# EAGLE design LED Tester (EAGLE 9.6.2)
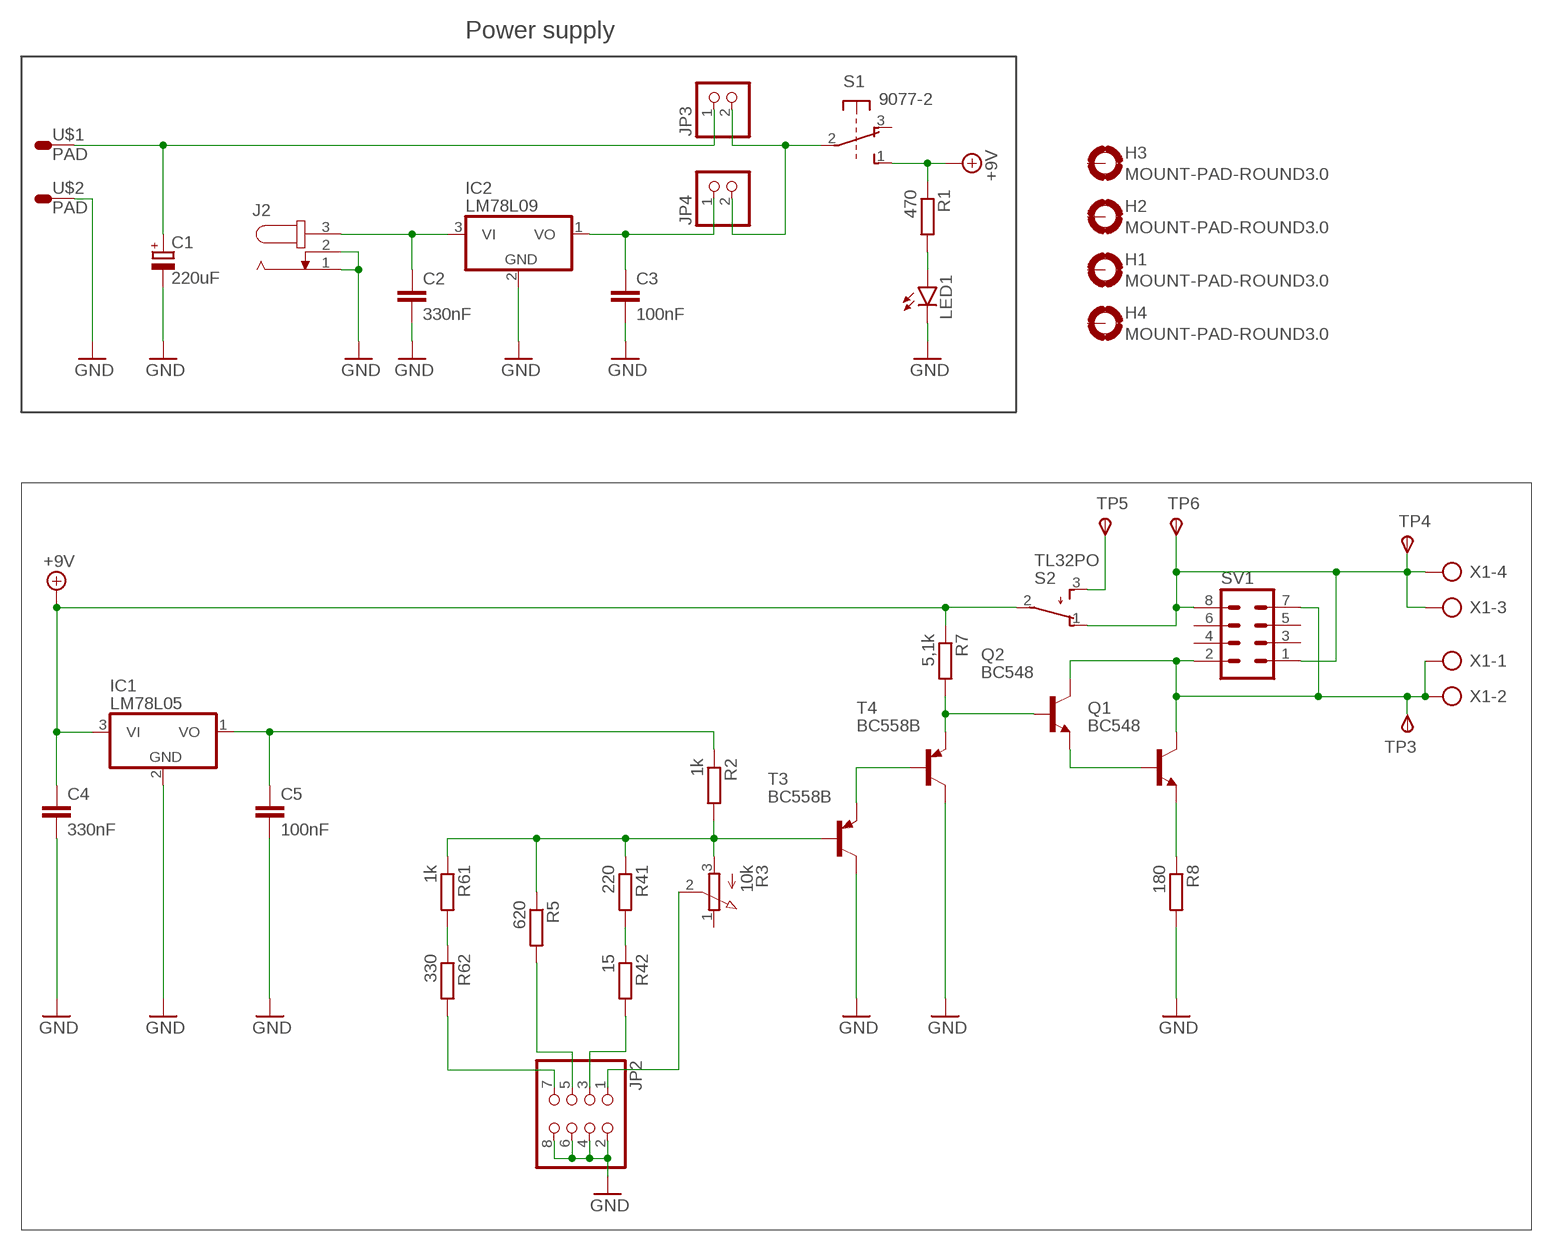
[diagram p0: schematic, sheet 1]

## Parts
C1  220uF  CPOL-EUE3.5-8  [E3,5-8]
C2  330nF  C-EU050-024X044  [C050-024X044]
C3  100nF  C-EU050-024X044  [C050-024X044]
C4  330nF  C-EU050-024X044  [C050-024X044]
C5  100nF  C-EU050-024X044  [C050-024X044]
H1  MOUNT-PAD-ROUND3.0  [3,0-PAD]
H2  MOUNT-PAD-ROUND3.0  [3,0-PAD]
H3  MOUNT-PAD-ROUND3.0  [3,0-PAD]
H4  MOUNT-PAD-ROUND3.0  [3,0-PAD]
IC1  LM78L05  LM78LXX  [TO92]
IC2  LM78L09  LM78LXX  [TO92]
J2  JACK-PLUG0  [SPC4077]
JP2  PINHD-2X4  [2X04]
JP3  PINHD-1X2  [1X02]
JP4  PINHD-1X2  [1X02]
LED1  LED3MM  [LED3MM]
Q1  BC548  [TO92-EBC]
Q2  BC548  [TO92-EBC]
R1  470  R-EU_0204/7  [0204/7]
R2  1k  R-EU_0207/10  [0207/10]
R3  10k  POT16/6MM  [POT/LAY/16/6MM]
R5  620  R-EU_0204/7  [0204/7]
R7  5,1k  R-EU_0207/10  [0207/10]
R8  180  R-EU_0204/7  [0204/7]
R41  220  R-EU_0204/7  [0204/7]
R42  15  R-EU_0204/7  [0204/7]
R61  1k  R-EU_0204/7  [0204/7]
R62  330  R-EU_0204/7  [0204/7]
S1  9077-2  [9077-2]
S2  TL32PO  [TL3XPO]
SV1  MA04-2  [MA04-2]
T3  BC558B  2N4126-PNP-TO92-CBE  [TO92-CBE]
T4  BC558B  2N4126-PNP-TO92-CBE  [TO92-CBE]
TP3  TPSPAD1-13  [P1-13]
TP4  TPSPAD1-13  [P1-13]
TP5  TPSPAD1-13  [P1-13]
TP6  TPSPAD1-13  [P1-13]
U$1  PAD  PAD/BOTTOM  [PAD/BOTTOM]
U$2  PAD  PAD/BOTTOM  [PAD/BOTTOM]
X1  AK500/4  [AK500/4]

## Nets
+9V: C4.1 IC1.3(VI) R1.1 R7.1 S1.1(1:S) S2.2(P)
GND: C1.- C2.2 C3.2 C4.2 C5.2 IC1.2(GND) IC2.2(GND) J2.1 J2.2 JP2.2 JP2.4 JP2.6 JP2.8 LED1.K(C) R8.2 T3.C T4.C U$2.P$1(S)
N$1: C1.+ JP3.1 U$1.P$1(S)
N$2: JP3.2 JP4.2 S1.2(1:P)
N$3: Q1.C Q2.C SV1.2 SV1.7 TP3.TP(PP) X1.1 X1.2
N$4: LED1.A R1.2
N$5: C3.1 IC2.1(VO) JP4.1
N$6: C5.1 IC1.1(VO) R2.1
N$7: C2.1 IC2.3(VI) J2.3
N$8: JP2.7 R62.2
N$9: R41.2 R42.1
N$10: Q1.E R8.1
N$11: R61.2 R62.1
N$12: JP2.5 R5.2
N$13: R2.2 R3.3(A) R5.1 R41.1 R61.1 T3.B
N$14: JP2.3 R42.2
N$15: T3.E T4.B
N$16: JP2.1 R3.2(S)
N$17: Q2.B R7.2 T4.E
N$18: Q1.B Q2.E
N$19: S2.3(S) TP5.TP(PP)
N$21: S2.1(O) SV1.1 SV1.8 TP4.TP(PP) TP6.TP(PP) X1.3 X1.4
Unconnected: H1.B3,0(MOUNT) H2.B3,0(MOUNT) H3.B3,0(MOUNT) H4.B3,0(MOUNT) R3.1(E) S1.3(1:O) S1.4(2:S) S1.5(2:P) S1.6(2:O) SV1.3 SV1.4 SV1.5 SV1.6

## Notes on the sheet
- Power supply

## Library data of the parts
C1 = rcl:CPOL-EU: POLARIZED CAPACITOR, European symbol
C2-C5 = rcl:C-EU: CAPACITOR, European symbol
H1-H4 = holes:MOUNT-PAD-ROUND: MOUNTING PAD, round
IC1 IC2 = lib_1:LM78LXX
J2 = con-jack:JACK-PLUG: DC POWER JACK Power Jack, DC, Right Angle, Through Hole, Rated 5A at 16VDC, PC Terminals Distributor: Farnell (www.Farnell.de) Drawing: 84N1161.pdf / 84N1162.pdf Manufacturer: SPC Technology (www.spctechnology.com) Type: SPC4077 / SPC 4078; OC_FARNELL: unknown; OC_NEWARK: unknown
JP2 = pinhead:PINHD-2X4: PIN HEADER
JP3 JP4 = pinhead:PINHD-1X2: PIN HEADER
LED1 = led:LED: LED OSRAM: - CHIPLED LG R971, LG N971, LY N971, LG Q971, LY Q971, LO R971, LY R971 LH N974, LH R974 LS Q976, LO Q976, LY Q976 LO Q996 - Hyper CHIPLED LW Q18S LB Q993, LB Q99A, LB R99A - SideLED LS A670, LO A670, LY A670, LG A670, LP A670 LB A673, LV A673, LT A673, LW A673 LH A674 LY A675 LS A676, LA A676, LO A676, LY A676, LW A676 LS A679, LY A679, LG A679 - Hyper Micro SIDELED® LS Y876, LA Y876, LO Y876, LY Y876 LT Y87S - SmartLED LW L88C, LW L88S LB L89C, LB L89S, LG L890 LS L89K, LO L89K, LY L89K LS L896, LA L896, LO L896, LY L896 - TOPLED LS T670, LO T670, LY T670, LG T670, LP T670 LSG T670, LSP T670, LSY T670, LOP T670, LYG T670 LG T671, LOG T671, LSG T671 LB T673, LV T673, LT T673, LW T673 LH T674 LS T676, LA T676, LO T676, LY T676, LB T676, LH T676, LSB T676, LW T676 LB T67C, LV T67C, LT T67C, LS T67K, LO T67K, LY T67K, LW E67C LS E67B, LA E67B, LO E67B, LY E67B, LB E67C, LV E67C, LT E67C LW T67C LS T679, LY T679, LG T679 LS T770, LO T770, LY T770, LG T770, LP T770 LB T773, LV T773, LT T773, LW T773 LH T774 LS E675, LA E675, LY E675, LS T675 LS T776, LA T776, LO T776, LY T776, LB T776 LHGB T686 LT T68C, LB T68C - Hyper Mini TOPLED® LB M676 - Mini TOPLED Santana® LG M470 LS M47K, LO M47K, LY M47K Source: http://www.osram.convergy.de LUXEON: - LUMILED® LXK2-PW12-R00, LXK2-PW12-S00, LXK2-PW14-U00, LXK2-PW14-V00 LXK2-PM12-R00, LXK2-PM12-S00, LXK2-PM14-U00 LXK2-PE12-Q00, LXK2-PE12-R00, LXK2-PE12-S00, LXK2-PE14-T00, LXK2-PE14-U00 LXK2-PB12-K00, LXK2-PB12-L00, LXK2-PB12-M00, LXK2-PB14-N00, LXK2-PB14-P00, LXK2-PB14-Q00 LXK2-PR12-L00, LXK2-PR12-M00, LXK2-PR14-Q00, LXK2-PR14-R00 LXK2-PD12-Q00, LXK2-PD12-R00, LXK2-PD12-S00 LXK2-PH12-R00, LXK2-PH12-S00 LXK2-PL12-P00, LXK2-PL12-Q00, LXK2-PL12-R00 Source: www.luxeon.com KINGBRIGHT: KA-3528ASYC Source: www.kingbright.com
Q1 Q2 = transistor-npn:BC548*: NPN Transistor
R1 R2 R5 R7 R8 R41 R42 R61 R62 = rcl:R-EU_: RESISTOR, European symbol; SPICEPREFIX: R
R3 = lib_1:POT16/6MM
S1 = switch-misc:9077-2: MARQUARDT SWITCH 9077.0200 Distributor: Buerklin <https://www.buerklin.com/default.asp?event=ShowArtikel%2812G2822%29&l=d&jump=ArtNr_12G2822>
S2 = switch:TL32PO: TINY SWITCH ON - MOM Source: http://www2.produktinfo.conrad.com/datenblaetter/700000-724999/705152-da-01-de-Subminiaturschalter_TL_36YO.pdf
SV1 = con-lstb:MA04-2: PIN HEADER; OC_FARNELL: unknown; OC_NEWARK: unknown
T3 T4 = transistor:*-PNP-: PNP Transistror
TP3-TP6 = testpad:TPS: TEST PIN
U$1 U$2 = lib_1:PAD/BOTTOM
X1 = con-ptr500:AK500/4: CONNECTOR; OC_FARNELL: unknown; OC_NEWARK: unknown

## Board
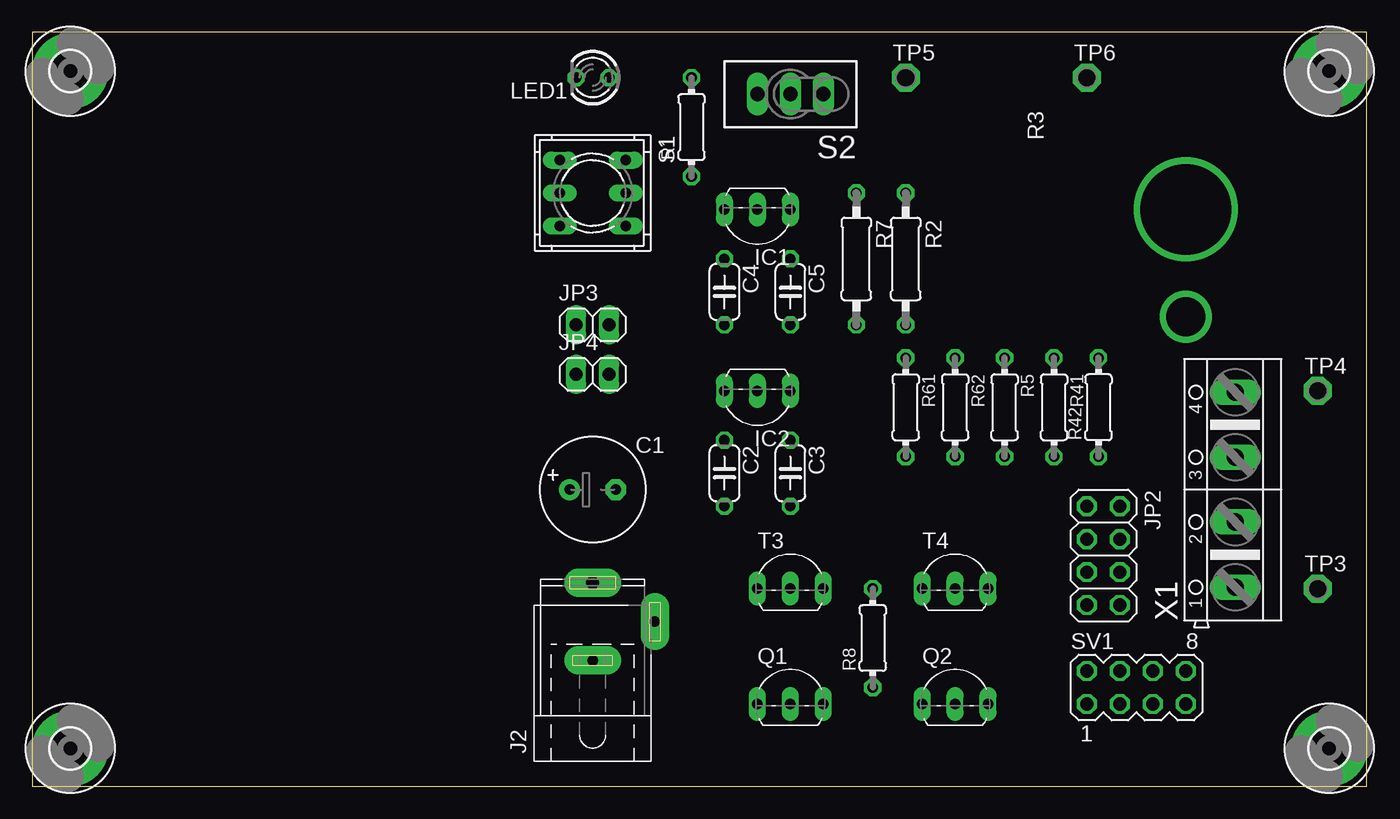
[diagram p1: board, top side]
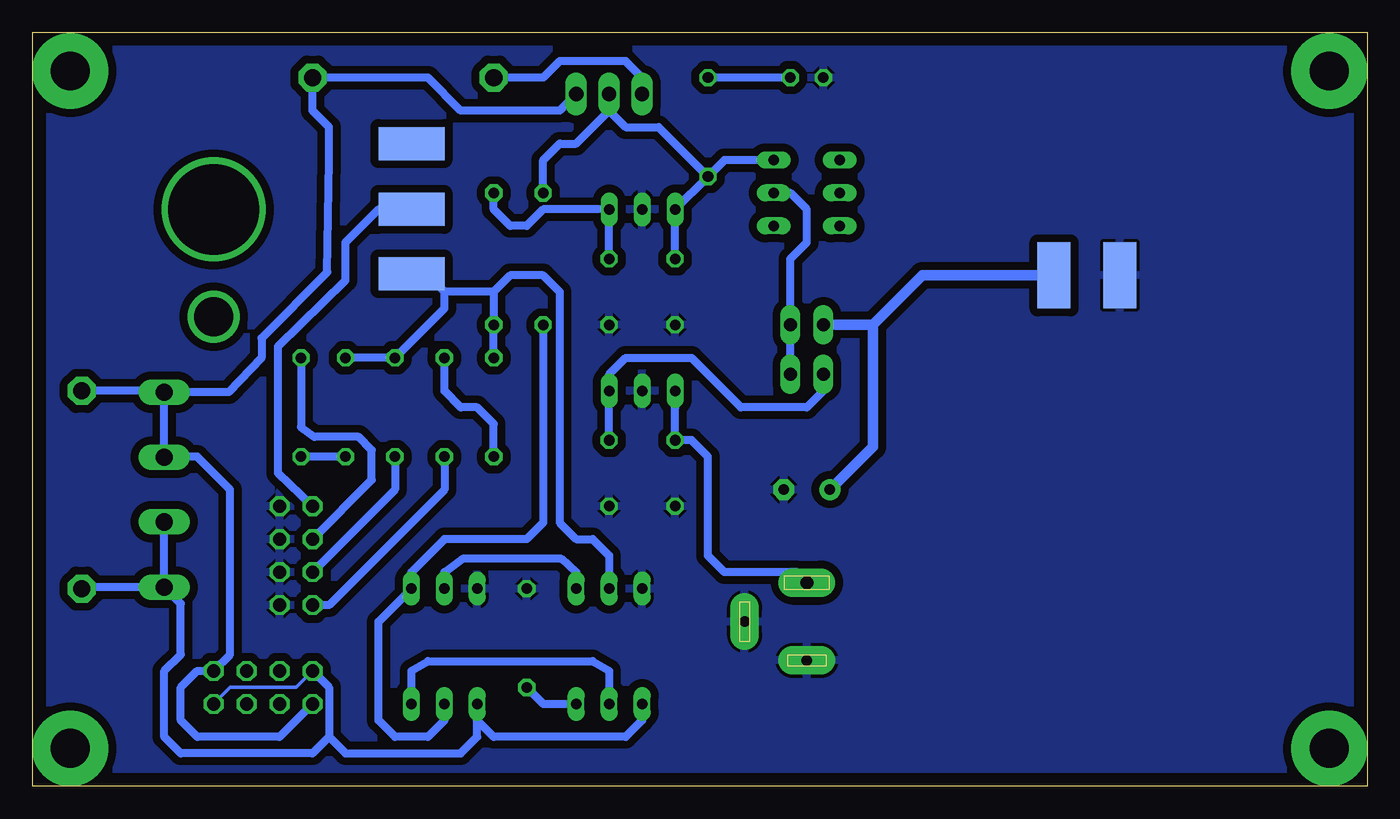
[diagram p2: board, bottom side, seen from below]

Size 102.85 x 58.09 mm. Coordinates in mm from the lower left corner, seen from the top.
Outline: 0,0 102.85,0 102.85,58.09 0,58.09 0,0
Copper layers (1*16): Top 0.035mm / dielectric 1.5mm / Bottom 0.035mm
Design rules "default": minimum track width 6mil, minimum drill 0.35mm, track to track 6mil, track to pad 6mil, pad to pad 6mil, via to via 6mil, smd to smd 6mil, copper to edge 40mil, drill to drill 6mil, minimum pad ring 10mil, minimum via ring 8mil, stop-mask expansion 4mil, vias tented up to drill 0mil, thermal gap 10mil

### Footprints (pad centres in the part's own frame; a part is rotated, then mirrored left to right if it is on the bottom)
E3,5-8 = drill 0.813 pad 1.6: + -1.778,0 | drill 0.813 pad 1.6 octagon: - 1.778,0
C050-024X044 = drill 0.813 octagon: 1 -2.54,0; 2 2.54,0
3,0-PAD = drill 3 pad 5.842: B3,0 0,0
TO92 = drill 0.813 long: 1 -2.54,0; 2 0,0; 3 2.54,0
SPC4077 = drill 0.8 pad 2.184 long: 1 -3,0; 2 0,-4.8 | drill 1 pad 2.184 long: 3 3,0
2X04 = drill 1.016 octagon: 1 -3.81,-1.27; 2 -3.81,1.27; 3 -1.27,-1.27; 4 -1.27,1.27; 5 1.27,-1.27; 6 1.27,1.27; 7 3.81,-1.27; 8 3.81,1.27
1X02 = drill 1.016 long: 1 -1.27,0; 2 1.27,0
LED3MM = drill 0.813 octagon: A -1.27,0; K 1.27,0
TO92-EBC = drill 0.813 long: B 0,-1.27; C -2.54,-1.27; E 2.54,-1.27
0204/7 = drill 0.813 octagon: 1 -3.81,0; 2 3.81,0
0207/10 = drill 0.813 octagon: 1 -5.08,0; 2 5.08,0
POT/LAY/16/6MM = smd 2.54 x 5.08 bottom: 1 -5.08,-10.16; 2 0,-10.16; 3 4.953,-10.16 | drill 7: P1 0,5.08 | drill 3: P2 8.255,5.08
9077-2 = drill 0.813 long: 1 -2.54,2.54; 2 0,2.54; 3 2.54,2.54; 4 -2.54,-2.54; 5 0,-2.54; 6 2.54,-2.54
TL3XPO = drill 1.1 pad 1.422 long: 1 -2.54,0; 2 0,0; 3 2.54,0
MA04-2 = drill 1.016 octagon: 1 -3.81,-1.27; 2 -3.81,1.27; 3 -1.27,-1.27; 4 -1.27,1.27; 5 1.27,-1.27; 6 1.27,1.27; 7 3.81,-1.27; 8 3.81,1.27
TO92-CBE = drill 0.813 long: B 0,0; C -2.54,0; E 2.54,0
P1-13 = drill 1.321 pad 2.159 octagon: TP 0,0
PAD/BOTTOM = smd 2.54 x 5.08 bottom: P$1 0,0
AK500/4 = drill 1.321 long: 1 -7.518,0; 2 -2.489,0; 3 2.489,0; 4 7.518,0

### Placement (x,y rotation side)
C1  43.18,22.86 0 top
C2  53.34,24.13 270 top
C3  58.42,24.13 270 top
C4  53.34,38.1 270 top
C5  58.42,38.1 270 top
H1  2.92,2.92 0 top
H2  99.95,2.92 0 top
H3  2.92,55.12 0 top
H4  99.95,55.12 0 top
IC1  55.88,44.45 180 top
IC2  55.88,30.48 180 top
J2  43.18,12.7 90 top
JP2  82.55,17.78 270 top
JP3  43.18,35.56 0 top
JP4  43.18,31.75 0 top
LED1  43.18,54.61 180 top
Q1  58.42,7.62 0 top
Q2  71.12,7.62 0 top
R1  50.8,50.8 90 top
R2  67.31,40.64 270 top
R3  83.82,44.45 270 top
R5  74.93,29.21 270 top
R7  63.5,40.64 270 top
R8  64.77,11.43 90 top
R41  78.74,29.21 270 top
R42  82.17,29.21 90 top
R61  67.31,29.21 270 top
R62  71.12,29.21 270 top
S1  43.18,45.72 270 top
S2  58.42,53.34 180 top
SV1  85.09,7.62 0 top
T3  58.42,15.24 0 top
T4  71.12,15.24 0 top
TP3  99.06,15.24 0 top
TP4  99.06,30.48 0 top
TP5  67.31,54.61 0 top
TP6  81.28,54.61 0 top
U$1  24.13,39.37 0 top
U$2  19.05,39.37 0 top
X1  92.71,22.86 90 top

### Tracks (layer width: path | path; a pad name or v marks a point on that pad's centre or on a via)
+9V
  Bottom 0.61: C4.1 IC1.3 R1.1 | S1.1 49.53,48.26 R1.1 | S2.2 58.42,52.07 | 58.42,52.07 57.15,50.8 54.61,50.8 R1.1 | R7.1 63.5,48.26 62.23,49.53 60.96,49.53 58.42,52.07
GND
  pour Bottom (isolate 0.61): -1.27,59.69 -1.27,-2.54 105.41,-2.54 105.41,59.69
N$1
  Bottom 0.813: 38.1,35.56 JP3.1 | U$1.P$1 34.29,39.37 38.1,35.56 | C1.+ 38.1,26.16 38.1,35.56
N$2
  Bottom 0.61: 44.45,36.83 JP3.2 | JP4.2 JP3.2 | JP3.2 44.45,40.64 43.18,41.91 43.18,44.45 44.45,45.72 S1.2
N$3
  Bottom 0.254: SV1.7 87.63,7.62 82.55,7.62 SV1.2
  Bottom 0.61: Q1.C 55.88,5.08 57.15,3.81 67.31,3.81 68.58,5.08 Q2.C 68.58,3.81 69.85,2.54 78.74,2.54 80.01,3.81 | SV1.2 80.01,7.62 80.01,3.81 | 80.01,3.81 81.28,2.54 91.44,2.54 92.71,3.81 92.71,8.89 91.44,10.16 91.44,14.07 X1.1 | X1.1 X1.2 | TP3.TP 98.96,15.34 X1.1
N$4
  Bottom 0.61: LED1.A R1.2
N$5
  Bottom 0.61: JP4.1 41.91,30.48 43.18,29.21 48.26,29.21 52.07,33.02 57.15,33.02 58.42,31.75 IC2.1 C3.1
N$6
  Bottom 0.61: C5.1 IC1.1 63.5,44.45 64.77,43.18 66.04,43.18 67.31,44.45 R2.1
N$7
  Bottom 0.61: J2.3 43.99,16.51 49.53,16.51 50.8,17.78 50.8,25.4 52.07,26.67 C2.1 53.34,29.21 IC2.3
N$8
  Bottom 0.61: R62.2 71.12,22.86 80.01,13.97 JP2.7
N$9
  Bottom 0.61: R41.2 R42.1
N$10
  Bottom 0.61: R8.1 63.5,6.35 Q1.E
N$11
  Bottom 0.61: 71.12,31.75 R62.1 71.12,30.48 69.85,29.21 68.58,29.21 67.31,27.94 R61.2
N$12
  Bottom 0.61: R5.2 74.93,22.86 JP2.5
N$13
  Bottom 0.61: R41.1 R5.1 71.12,36.83 71.12,38.1 | T3.B 58.42,17.78 59.69,19.05 60.96,19.05 62.23,20.32 62.23,38.1 63.5,39.37 66.04,39.37 67.31,38.1 | 73.79,39.5 R3.3 73.66,39.37 72.39,39.37 71.12,38.1 | R61.1 R2.2 67.31,38.1 | 67.31,38.1 71.12,38.1
N$14
  Bottom 0.61: R42.2 82.17,27.69 81.15,26.92 77.72,26.92 76.71,25.91 76.71,23.62 JP2.3
N$15
  Bottom 0.61: T3.E 60.96,16.51 62.1,17.53 69.72,17.53 71.12,16.51 T4.B
N$16
  Bottom 0.61: R3.2 76.2,44.45 78.74,41.91 78.74,38.99 83.95,33.91 83.95,24.13 JP2.1
N$17
  Bottom 0.61: Q2.B 71.12,5.08 72.39,3.81 74.93,3.81 76.2,5.08 76.2,12.7 T4.E 73.66,16.51 71.12,19.05 64.77,19.05 63.5,20.32 R7.2
N$18
  Bottom 0.61: Q1.B 58.42,8.89 59.69,9.65 72.39,9.65 73.66,8.89 Q2.E
N$19
  Bottom 0.61: S2.3 55.88,54.61 57.15,55.88 62.23,55.88 63.5,54.61 TP5.TP
N$21
  Bottom 0.61: SV1.1 83.82,3.81 90.17,3.81 91.44,5.08 91.44,7.62 90.17,8.89 SV1.8 87.63,10.16 87.63,22.86 90.17,25.4 92.71,25.4 | S2.1 62.23,52.07 69.85,52.07 72.39,54.61 TP6.TP 81.28,52.07 80.01,50.8 80.01,48.26 80.14,39.62 85.22,34.54 85.22,33.02 87.73,30.38 X1.4 | X1.3 92.71,25.4 | 92.71,25.4 X1.4 | X1.4 92.81,30.48 TP4.TP